# EAGLE schematic OBC (EAGLE 9.6.0)

## Sheet 1 of 6: SMC General
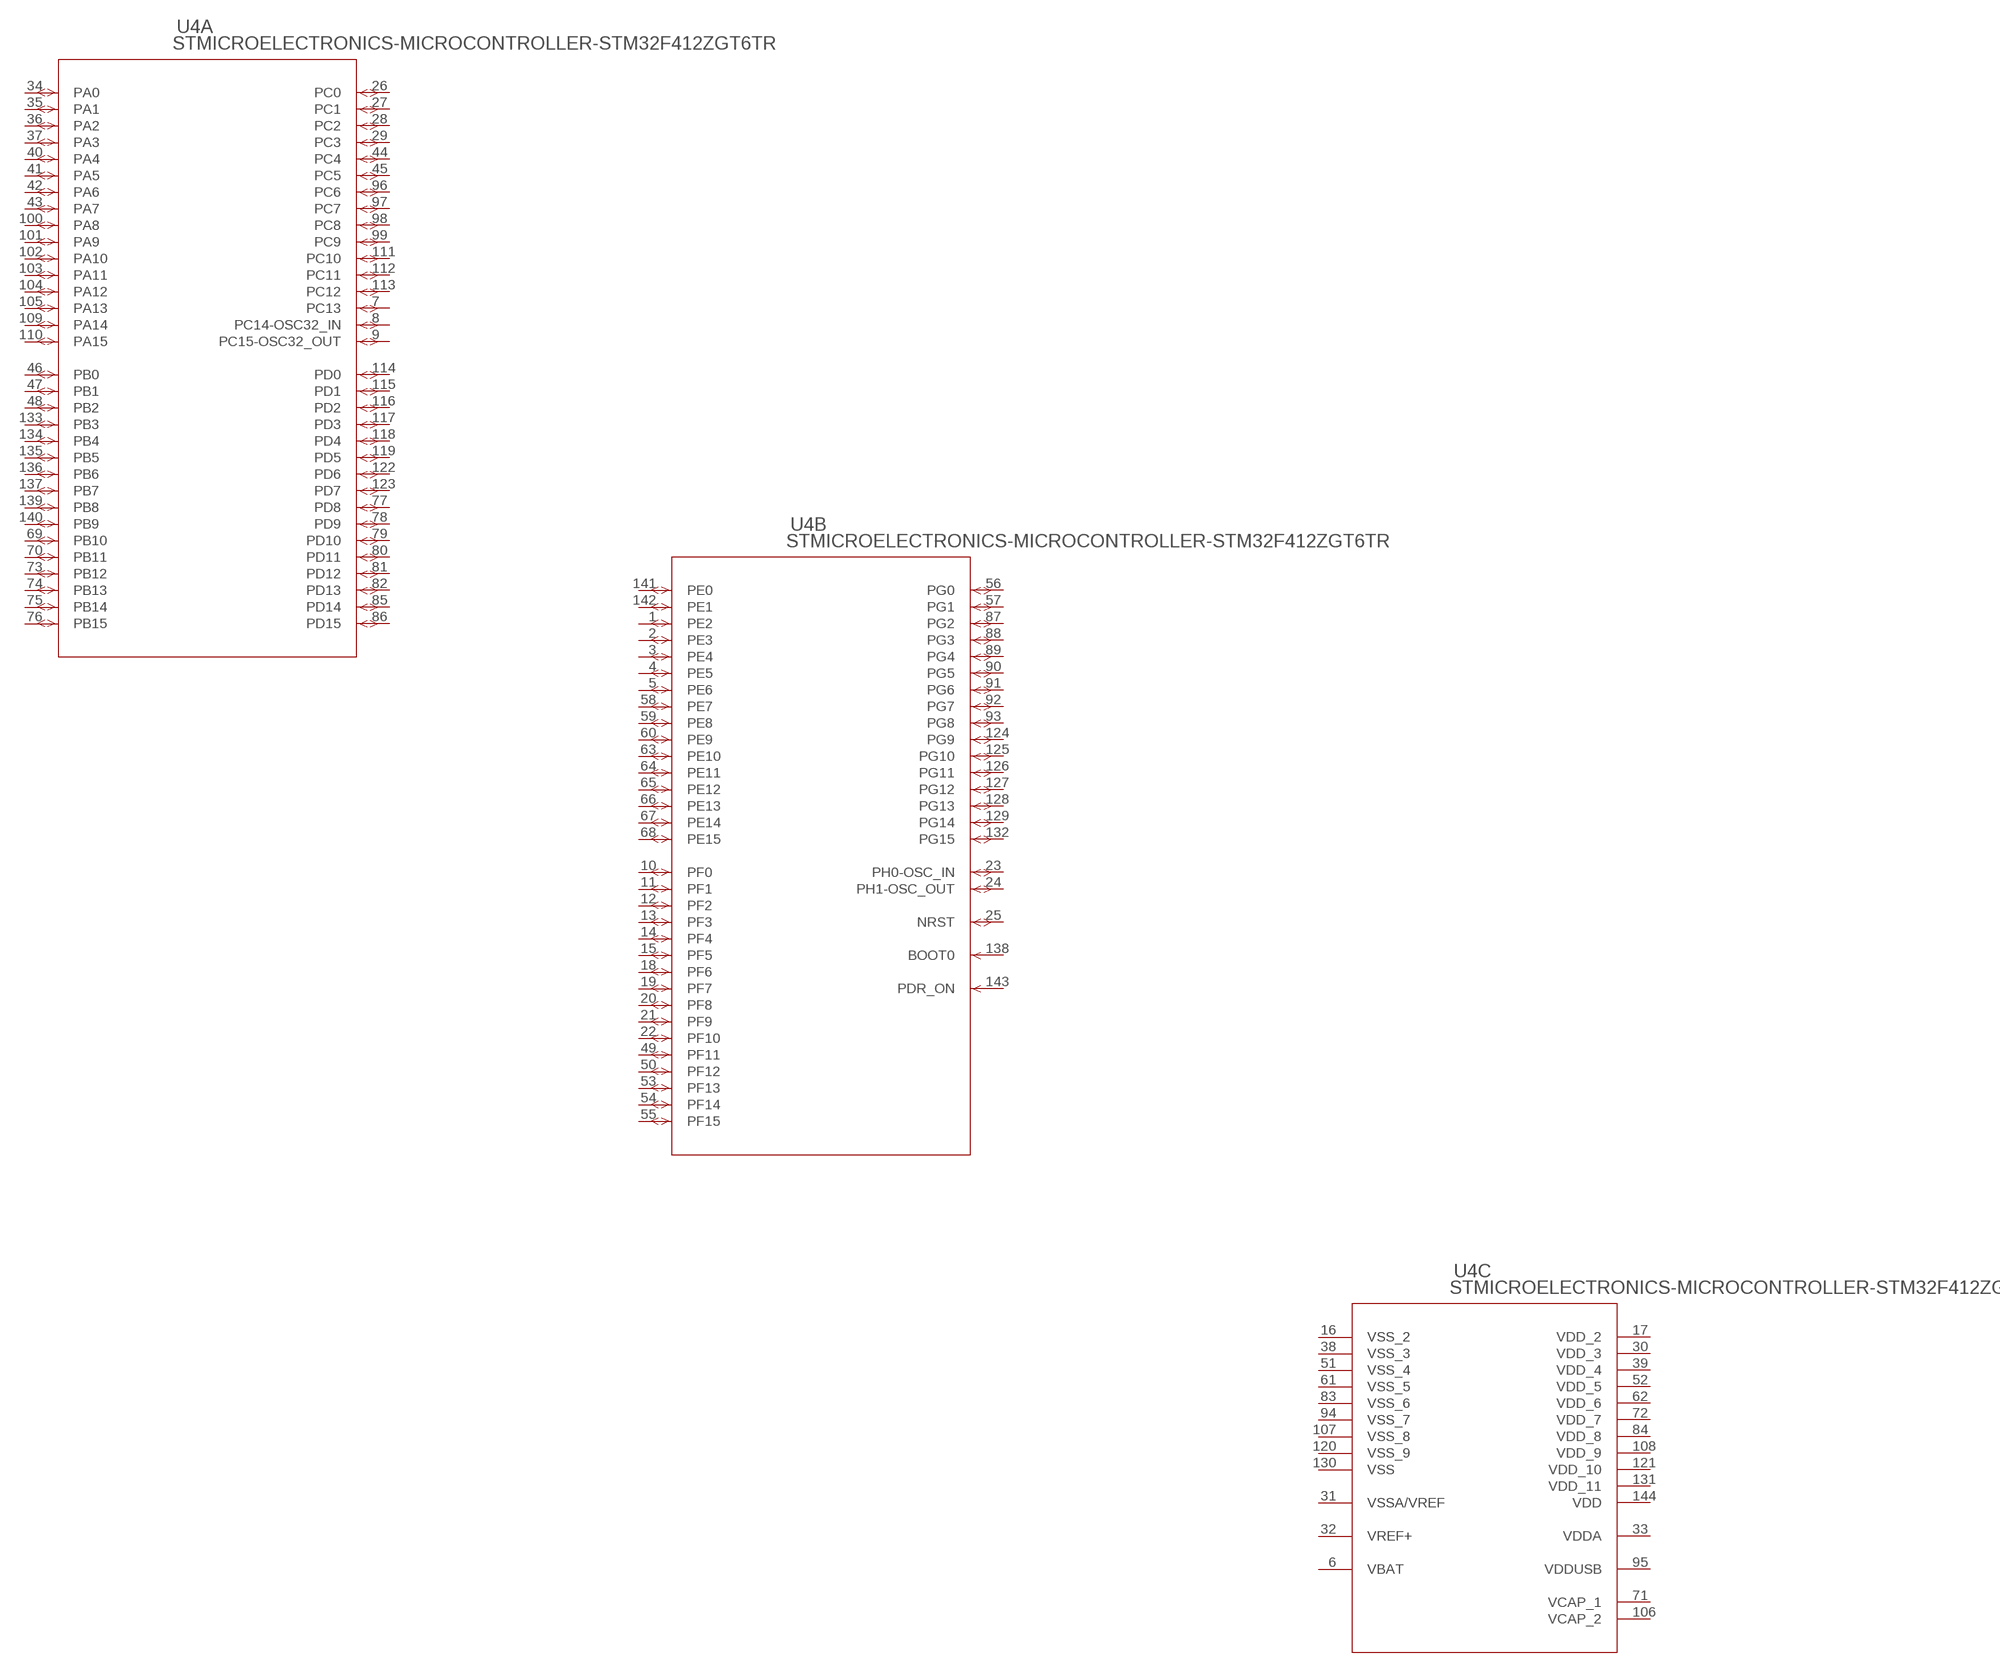
[diagram p0: schematic, sheet 1]

### Parts
U4  STMICROELECTRONICS-MICROCONTROLLER-STM32F412ZGT6TR  [STMICROELECTRONICS-MICROCONTROLLER-STM32F412ZGT6TR]
Unconnected: U4.1(B:PE2) U4.2(B:PE3) U4.3(B:PE4) U4.4(B:PE5) U4.5(B:PE6) U4.7(A:PC13) U4.8(A:PC14-OSC32_IN) U4.9(A:PC15-OSC32_OUT) U4.10(B:PF0) U4.11(B:PF1) U4.12(B:PF2) U4.13(B:PF3) U4.14(B:PF4) U4.15(B:PF5) U4.18(B:PF6) U4.19(B:PF7) U4.20(B:PF8) U4.21(B:PF9) U4.22(B:PF10) U4.23(B:PH0-OSC_IN) U4.24(B:PH1-OSC_OUT) U4.25(B:NRST) U4.26(A:PC0) U4.27(A:PC1) U4.28(A:PC2) U4.29(A:PC3) U4.34(A:PA0) U4.35(A:PA1) U4.36(A:PA2) U4.37(A:PA3) U4.40(A:PA4) U4.41(A:PA5) U4.42(A:PA6) U4.43(A:PA7) U4.44(A:PC4) U4.45(A:PC5) U4.46(A:PB0) U4.47(A:PB1) U4.48(A:PB2) U4.49(B:PF11) U4.50(B:PF12) U4.53(B:PF13) U4.54(B:PF14) U4.55(B:PF15) U4.56(B:PG0) U4.57(B:PG1) U4.58(B:PE7) U4.59(B:PE8) U4.60(B:PE9) U4.63(B:PE10) U4.64(B:PE11) U4.65(B:PE12) U4.66(B:PE13) U4.67(B:PE14) U4.68(B:PE15) U4.69(A:PB10) U4.70(A:PB11) U4.73(A:PB12) U4.74(A:PB13) U4.75(A:PB14) U4.76(A:PB15) U4.77(A:PD8) U4.78(A:PD9) U4.79(A:PD10) U4.80(A:PD11) U4.81(A:PD12) U4.82(A:PD13) U4.85(A:PD14) U4.86(A:PD15) U4.87(B:PG2) U4.88(B:PG3) U4.89(B:PG4) U4.90(B:PG5) U4.91(B:PG6) U4.92(B:PG7) U4.93(B:PG8) U4.96(A:PC6) U4.97(A:PC7) U4.98(A:PC8) U4.99(A:PC9) U4.100(A:PA8) U4.101(A:PA9) U4.102(A:PA10) U4.103(A:PA11) U4.104(A:PA12) U4.105(A:PA13) U4.109(A:PA14) U4.110(A:PA15) U4.111(A:PC10) U4.112(A:PC11) U4.113(A:PC12) U4.114(A:PD0) U4.115(A:PD1) U4.116(A:PD2) U4.117(A:PD3) U4.118(A:PD4) U4.119(A:PD5) U4.122(A:PD6) U4.123(A:PD7) U4.124(B:PG9) U4.125(B:PG10) U4.126(B:PG11) U4.127(B:PG12) U4.128(B:PG13) U4.129(B:PG14) U4.132(B:PG15) U4.133(A:PB3) U4.134(A:PB4) U4.135(A:PB5) U4.136(A:PB6) U4.137(A:PB7) U4.138(B:BOOT0) U4.139(A:PB8) U4.140(A:PB9) U4.141(B:PE0) U4.142(B:PE1) U4.143(B:PDR_ON)

## Sheet 2 of 6: Regulator General
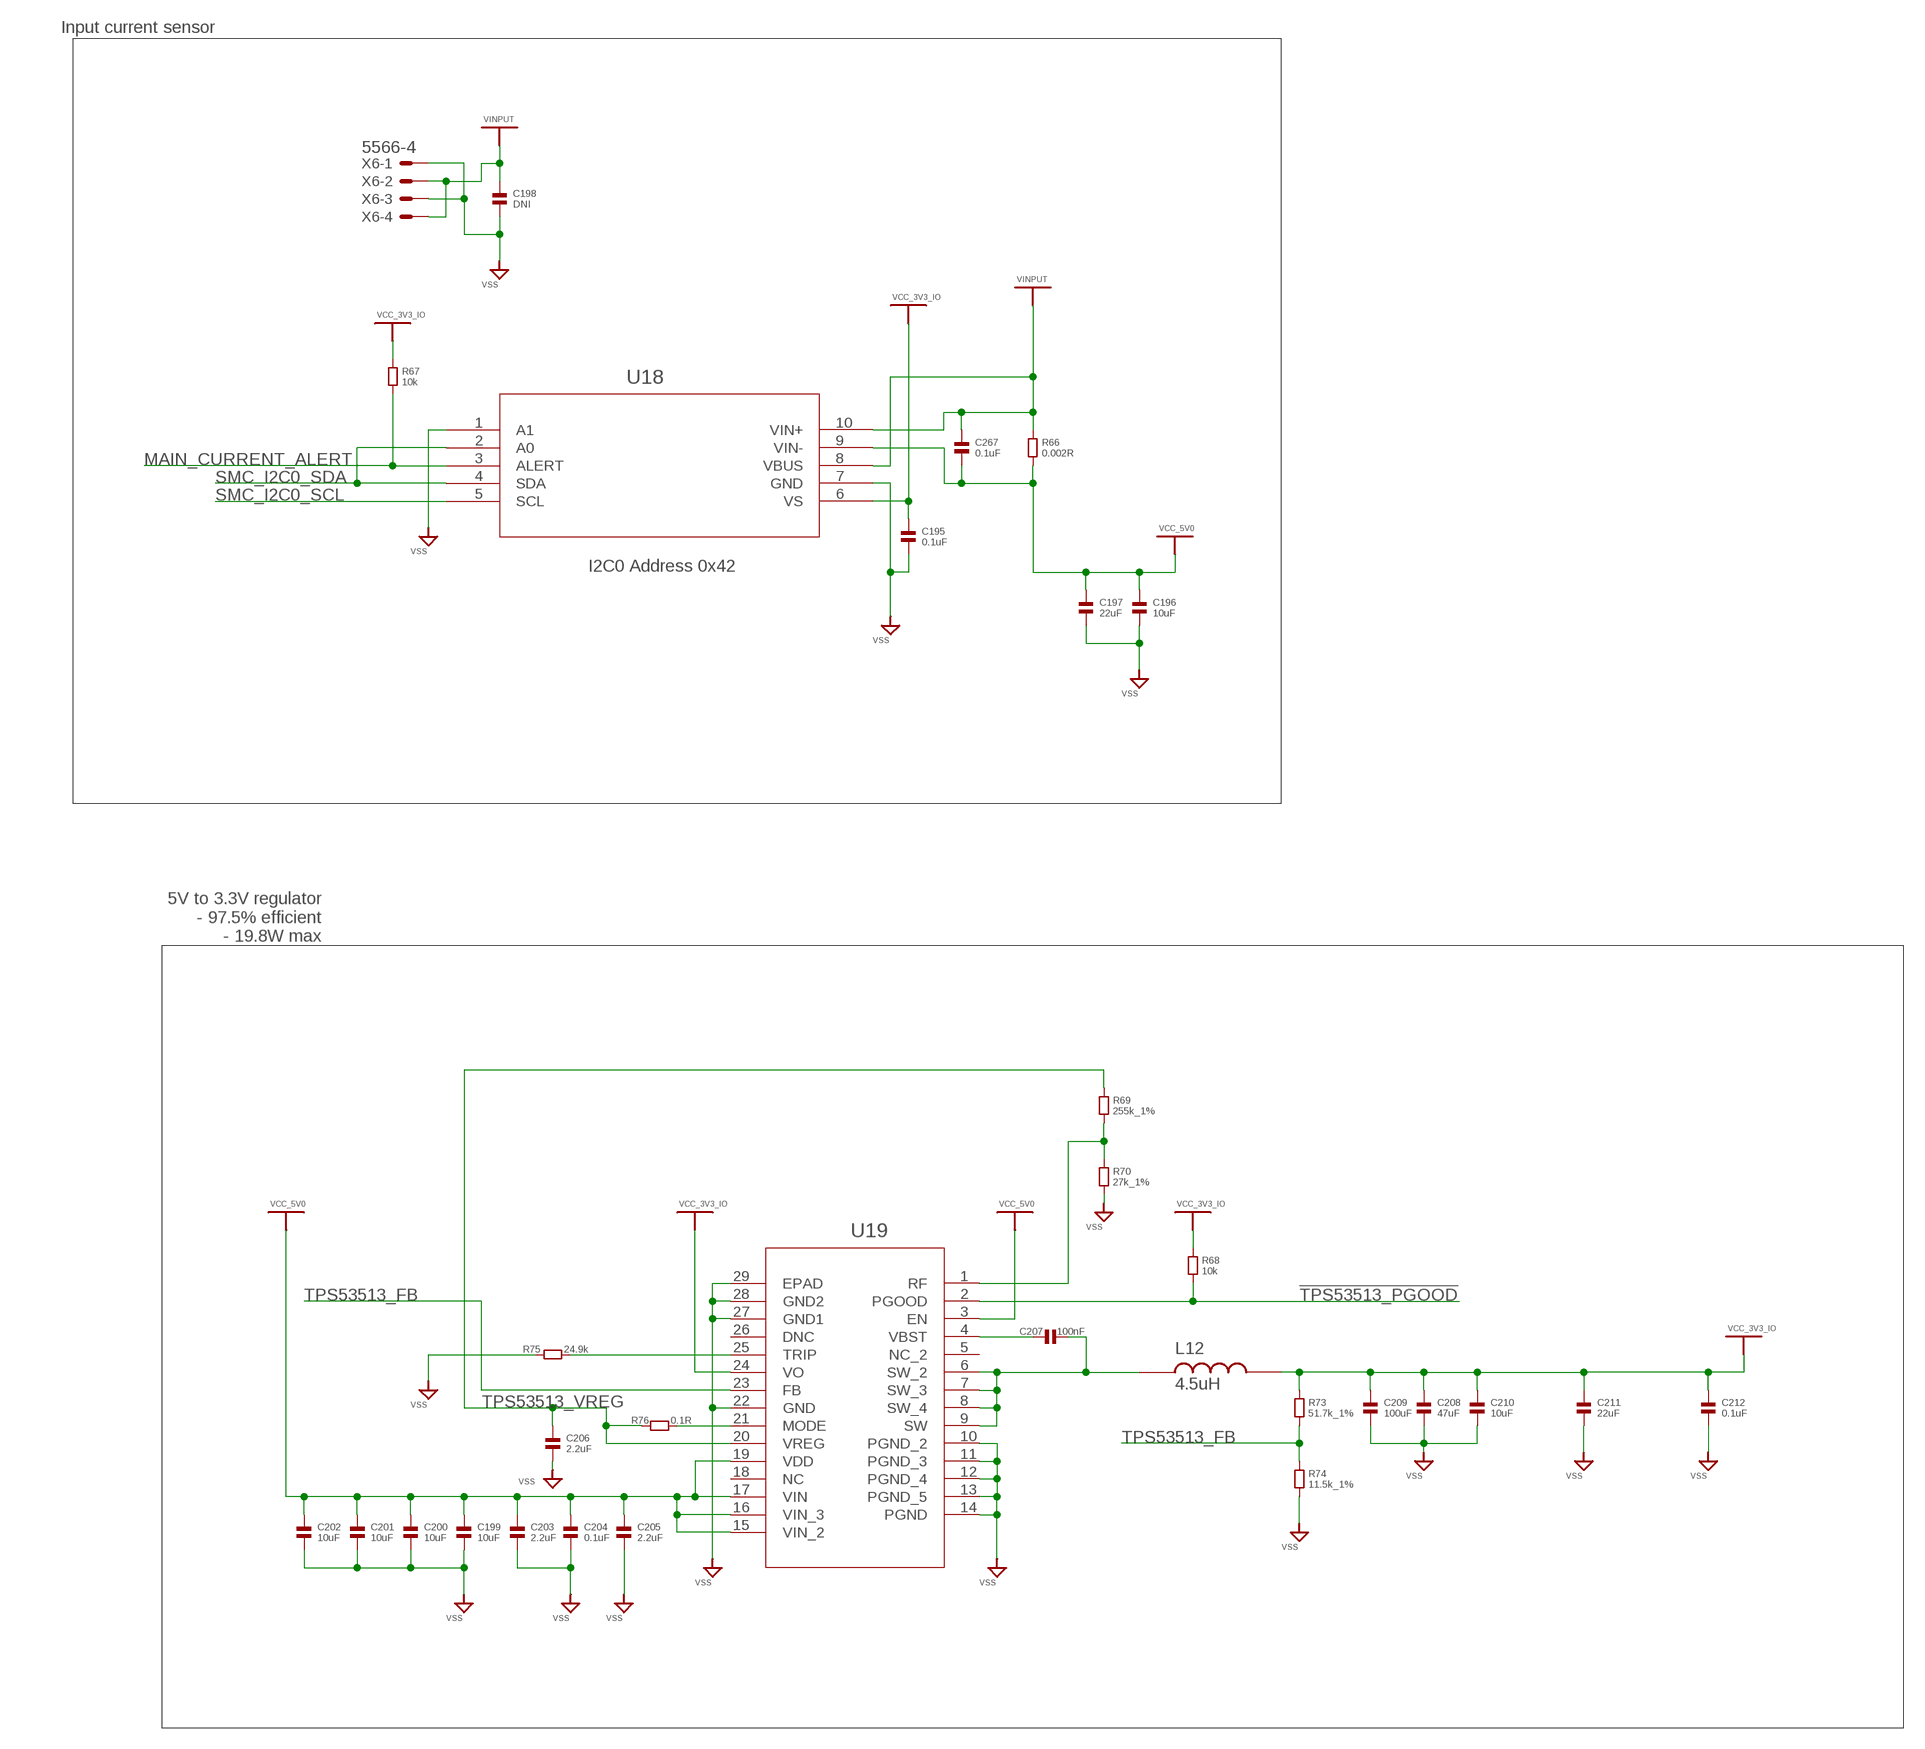
[diagram p1: schematic, sheet 2]

### Parts
C195  0.1uF  CAPACITOR.0603  [0603]
C196  10uF  CAPACITOR.0805  [0805]
C197  22uF  CAPACITOR.0805  [0805]
C198  DNI  CAPACITOR.0805  [0805]
C199  10uF  CAPACITOR.0805  [0805]
C200  10uF  CAPACITOR.0805  [0805]
C201  10uF  CAPACITOR.0805  [0805]
C202  10uF  CAPACITOR.0805  [0805]
C203  2.2uF  CAPACITOR.0603  [0603]
C204  0.1uF  CAPACITOR.0603  [0603]
C205  2.2uF  CAPACITOR.0603  [0603]
C206  2.2uF  CAPACITOR.0603  [0603]
C207  100nF  CAPACITOR.0805  [0805]
C208  47uF  CAPACITOR.1206  [1206]
C209  100uF  CAPACITOR.1206  [1206]
C210  10uF  CAPACITOR.0805  [0805]
C211  22uF  CAPACITOR.0805  [0805]
C212  0.1uF  CAPACITOR.0805  [0805]
C267  0.1uF  CAPACITOR.0603  [0603]
L12  4.5uH  BOURNS-INDUCTOR-SRR1208-4R5ML  [BOURNS-INDUCTOR-SRR1208-4R5ML]
R66  0.002R  RESISTOR.1812  [1812]
R67  10k  RESISTOR.0603  [0603]
R68  10k  RESISTOR.0603  [0603]
R69  255k_1%  RESISTOR.0603  [0603]
R70  27k_1%  RESISTOR.0603  [0603]
R73  51.7k_1%  RESISTOR.0603  [0603]
R74  11.5k_1%  RESISTOR.0603  [0603]
R75  24.9k  RESISTOR.0603  [0603]
R76  0.1R  RESISTOR.0603  [0603]
U18  TEXAS_INSTRUMENTS-CURRENT_MONITOR-INA226_DGS_10  [TEXAS_INSTRUMENTS-CURRENT_MONITOR-INA226_DGS_10]
U19  TEXAS_INSTRUMENTS-BUCK_CONVERTER-TPS53513RVER  [RVE28_TEX]
X6  5566-4  [5566-4]

### Nets
!TPS53513_PGOOD: R68.2 U19.2(PGOOD)
MAIN_CURRENT_ALERT: R67.2 U18.3(ALERT)
N$43: R69.2 R70.1 U19.1(RF)
N$46: C207.1 U19.4(VBST)
N$47: C207.2 L12.1 U19.6(SW_2) U19.7(SW_3) U19.8(SW_4) U19.9(SW)
N$48: R75.2 U19.25(TRIP)
N$49: R76.2 U19.21(MODE)
SMC_I2C0_SCL: U18.5(SCL) ; also sheet 3,4
SMC_I2C0_SDA: U18.2(A0) U18.4(SDA) ; also sheet 3,4
TPS53513_FB: R73.2 R74.1 U19.23(FB)
TPS53513_VREG: C206.1 R69.1 R76.1 U19.20(VREG)
VCC_3V3_IO: C195.1 C208.1 C209.1 C210.1 C211.1 C212.1 L12.2 R67.1 R68.1 R73.1 U18.6(VS) U19.24(VO) ; also sheet 3,4,5,6
VCC_5V0: C196.1 C197.1 C199.1 C200.1 C201.1 C202.1 C203.1 C204.1 C205.1 C267.2 R66.2 U18.9(VIN-) U19.3(EN) U19.15(VIN_2) U19.16(VIN_3) U19.17(VIN) U19.19(VDD) ; also sheet 3
VINPUT: C198.1 C267.1 R66.1 U18.8(VBUS) U18.10(VIN+) X6.2 X6.4
VSS: C195.2 C196.2 C197.2 C198.2 C199.2 C200.2 C201.2 C202.2 C203.2 C204.2 C205.2 C206.2 C208.2 C209.2 C210.2 C211.2 C212.2 R70.2 R74.2 R75.1 U18.1(A1) U18.7(GND) U19.10(PGND_2) U19.11(PGND_3) U19.12(PGND_4) U19.13(PGND_5) U19.14(PGND) U19.22(GND) U19.27(GND1) U19.28(GND2) U19.29(EPAD) X6.1 X6.3 ; also sheet 3,4,5,6
Unconnected: U19.5(NC_2) U19.18(NC) U19.26(DNC)

### Notes on the sheet
- Input current sensor
- I2C0 Address 0x42
- 5V to 3.3V regulator
  - 97.5% efficient
  - 19.8W max

## Sheet 3 of 6: Magnetorquer Drive Core
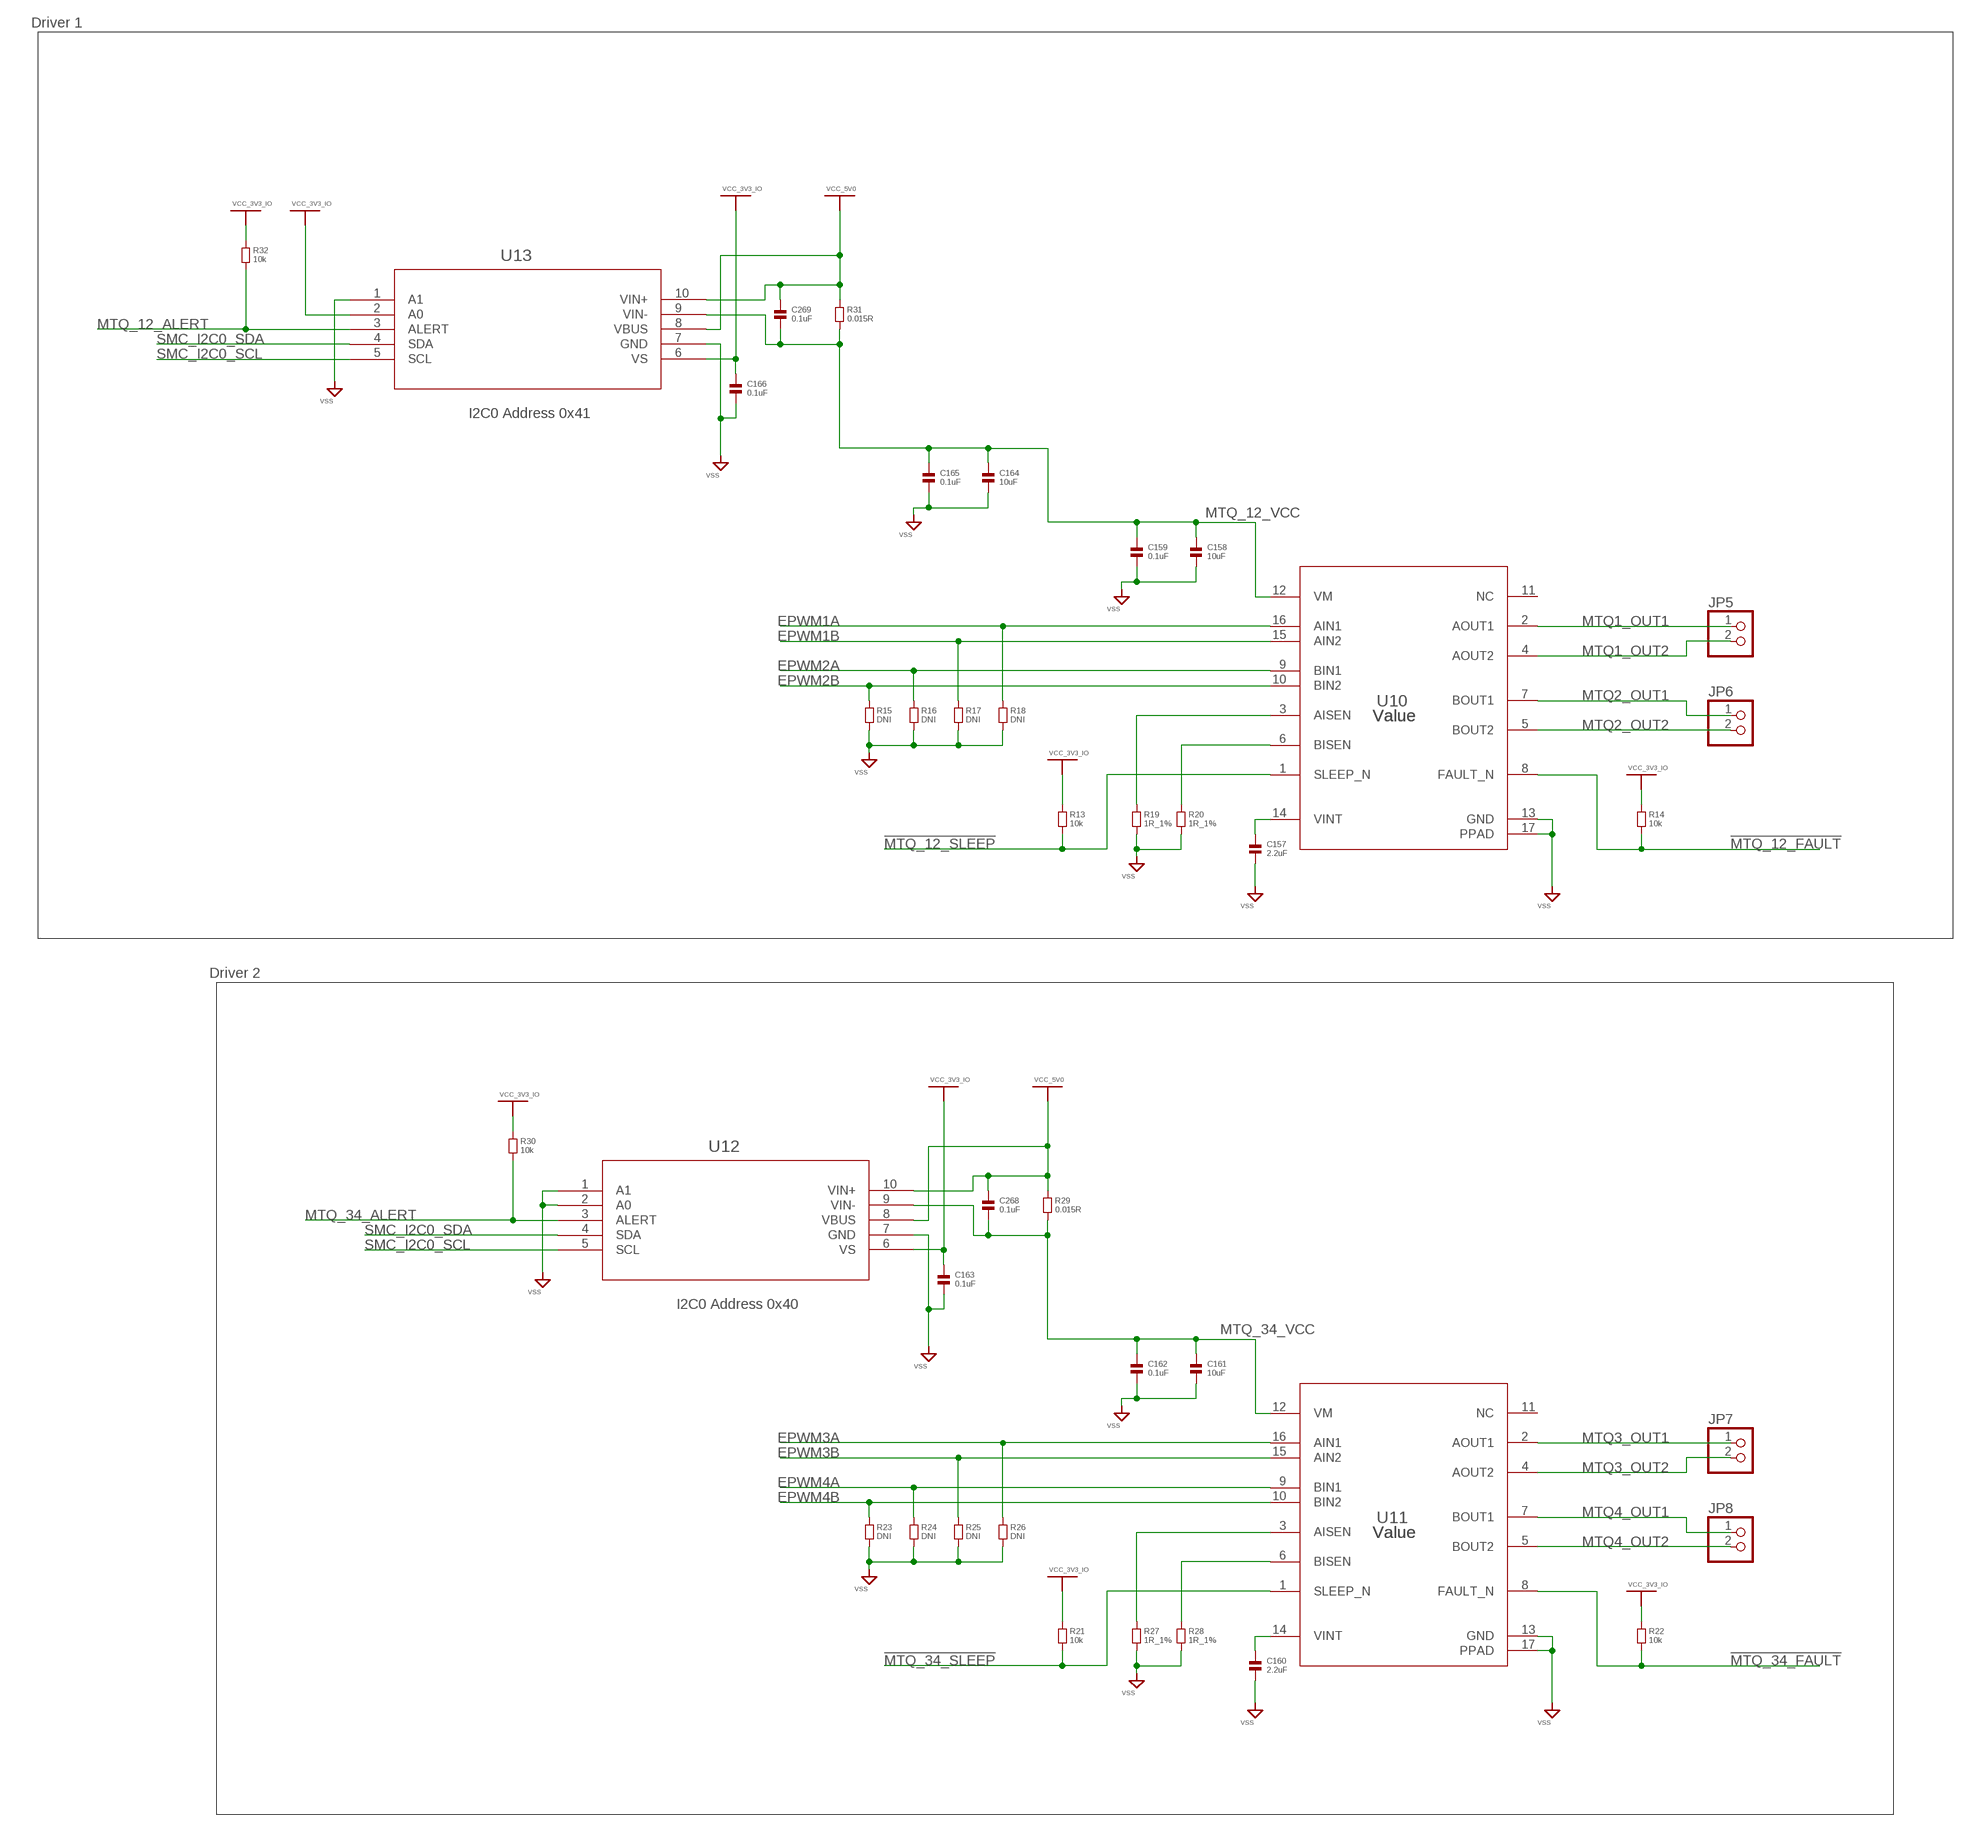
[diagram p2: schematic, sheet 3]

### Parts
C157  2.2uF  CAPACITOR.0603  [0603]
C158  10uF  CAPACITOR.0805  [0805]
C159  0.1uF  CAPACITOR.0603  [0603]
C160  2.2uF  CAPACITOR.0603  [0603]
C161  10uF  CAPACITOR.0805  [0805]
C162  0.1uF  CAPACITOR.0603  [0603]
C163  0.1uF  CAPACITOR.0603  [0603]
C164  10uF  CAPACITOR.0805  [0805]
C165  0.1uF  CAPACITOR.0603  [0603]
C166  0.1uF  CAPACITOR.0603  [0603]
C268  0.1uF  CAPACITOR.0603  [0603]
C269  0.1uF  CAPACITOR.0603  [0603]
JP5  PINHD-1X2  [1X02]
JP6  PINHD-1X2  [1X02]
JP7  PINHD-1X2  [1X02]
JP8  PINHD-1X2  [1X02]
R13  10k  RESISTOR.0603  [0603]
R14  10k  RESISTOR.0603  [0603]
R15  DNI  RESISTOR.0603  [0603]
R16  DNI  RESISTOR.0603  [0603]
R17  DNI  RESISTOR.0603  [0603]
R18  DNI  RESISTOR.0603  [0603]
R19  1R_1%  RESISTOR.0603  [0603]
R20  1R_1%  RESISTOR.0603  [0603]
R21  10k  RESISTOR.0603  [0603]
R22  10k  RESISTOR.0603  [0603]
R23  DNI  RESISTOR.0603  [0603]
R24  DNI  RESISTOR.0603  [0603]
R25  DNI  RESISTOR.0603  [0603]
R26  DNI  RESISTOR.0603  [0603]
R27  1R_1%  RESISTOR.0603  [0603]
R28  1R_1%  RESISTOR.0603  [0603]
R29  0.015R  RESISTOR.1206  [1206]
R30  10k  RESISTOR.0603  [0603]
R31  0.015R  RESISTOR.1206  [1206]
R32  10k  RESISTOR.0603  [0603]
U10  Value  TEXAS_INSTRUMENTS-MOTOR_PWM_DRIVER-DRV8833CPWP  [PWP0016K_N]
U11  Value  TEXAS_INSTRUMENTS-MOTOR_PWM_DRIVER-DRV8833CPWP  [PWP0016K_N]
U12  TEXAS_INSTRUMENTS-CURRENT_MONITOR-INA226_DGS_10  [TEXAS_INSTRUMENTS-CURRENT_MONITOR-INA226_DGS_10]
U13  TEXAS_INSTRUMENTS-CURRENT_MONITOR-INA226_DGS_10  [TEXAS_INSTRUMENTS-CURRENT_MONITOR-INA226_DGS_10]

### Nets
!MTQ_12_FAULT: R14.2 U10.8(FAULT_N)
!MTQ_12_SLEEP: R13.2 U10.1(SLEEP_N)
!MTQ_34_FAULT: R22.2 U11.8(FAULT_N)
!MTQ_34_SLEEP: R21.2 U11.1(SLEEP_N)
EPWM1A: R18.1 U10.16(AIN1)
EPWM1B: R17.1 U10.15(AIN2)
EPWM2A: R16.1 U10.9(BIN1)
EPWM2B: R15.1 U10.10(BIN2)
EPWM3A: R26.1 U11.16(AIN1)
EPWM3B: R25.1 U11.15(AIN2)
EPWM4A: R24.1 U11.9(BIN1)
EPWM4B: R23.1 U11.10(BIN2)
MTQ1_OUT1: JP5.1 U10.2(AOUT1)
MTQ1_OUT2: JP5.2 U10.4(AOUT2)
MTQ2_OUT1: JP6.1 U10.7(BOUT1)
MTQ2_OUT2: JP6.2 U10.5(BOUT2)
MTQ3_OUT1: JP7.1 U11.2(AOUT1)
MTQ3_OUT2: JP7.2 U11.4(AOUT2)
MTQ4_OUT1: JP8.1 U11.7(BOUT1)
MTQ4_OUT2: JP8.2 U11.5(BOUT2)
MTQ_12_ALERT: R32.2 U13.3(ALERT)
MTQ_12_VCC: C158.1 C159.1 C164.1 C165.1 C269.2 R31.2 U10.12(VM) U13.9(VIN-)
MTQ_34_ALERT: R30.2 U12.3(ALERT)
MTQ_34_VCC: C161.1 C162.1 C268.2 R29.2 U11.12(VM) U12.9(VIN-)
N$10: C157.1 U10.14(VINT)
N$12: R19.1 U10.3(AISEN)
N$13: R20.1 U10.6(BISEN)
N$14: C160.1 U11.14(VINT)
N$15: R27.1 U11.3(AISEN)
N$16: R28.1 U11.6(BISEN)
SMC_I2C0_SCL: U12.5(SCL) U13.5(SCL) ; also sheet 2,4
SMC_I2C0_SDA: U12.4(SDA) U13.4(SDA) ; also sheet 2,4
VCC_3V3_IO: C163.1 C166.1 R13.1 R14.1 R21.1 R22.1 R30.1 R32.1 U12.6(VS) U13.2(A0) U13.6(VS) ; also sheet 2,4,5,6
VCC_5V0: C268.1 C269.1 R29.1 R31.1 U12.8(VBUS) U12.10(VIN+) U13.8(VBUS) U13.10(VIN+) ; also sheet 2
VSS: C157.2 C158.2 C159.2 C160.2 C161.2 C162.2 C163.2 C164.2 C165.2 C166.2 R15.2 R16.2 R17.2 R18.2 R19.2 R20.2 R23.2 R24.2 R25.2 R26.2 R27.2 R28.2 U10.13(GND) U10.17(PPAD) U11.13(GND) U11.17(PPAD) U12.1(A1) U12.2(A0) U12.7(GND) U13.1(A1) U13.7(GND) ; also sheet 2,4,5,6
Unconnected: U10.11(NC) U11.11(NC)

### Notes on the sheet
- Driver 1
- I2C0 Address 0x41
- Driver 2
- I2C0 Address 0x40

## Sheet 4 of 6: IMUs
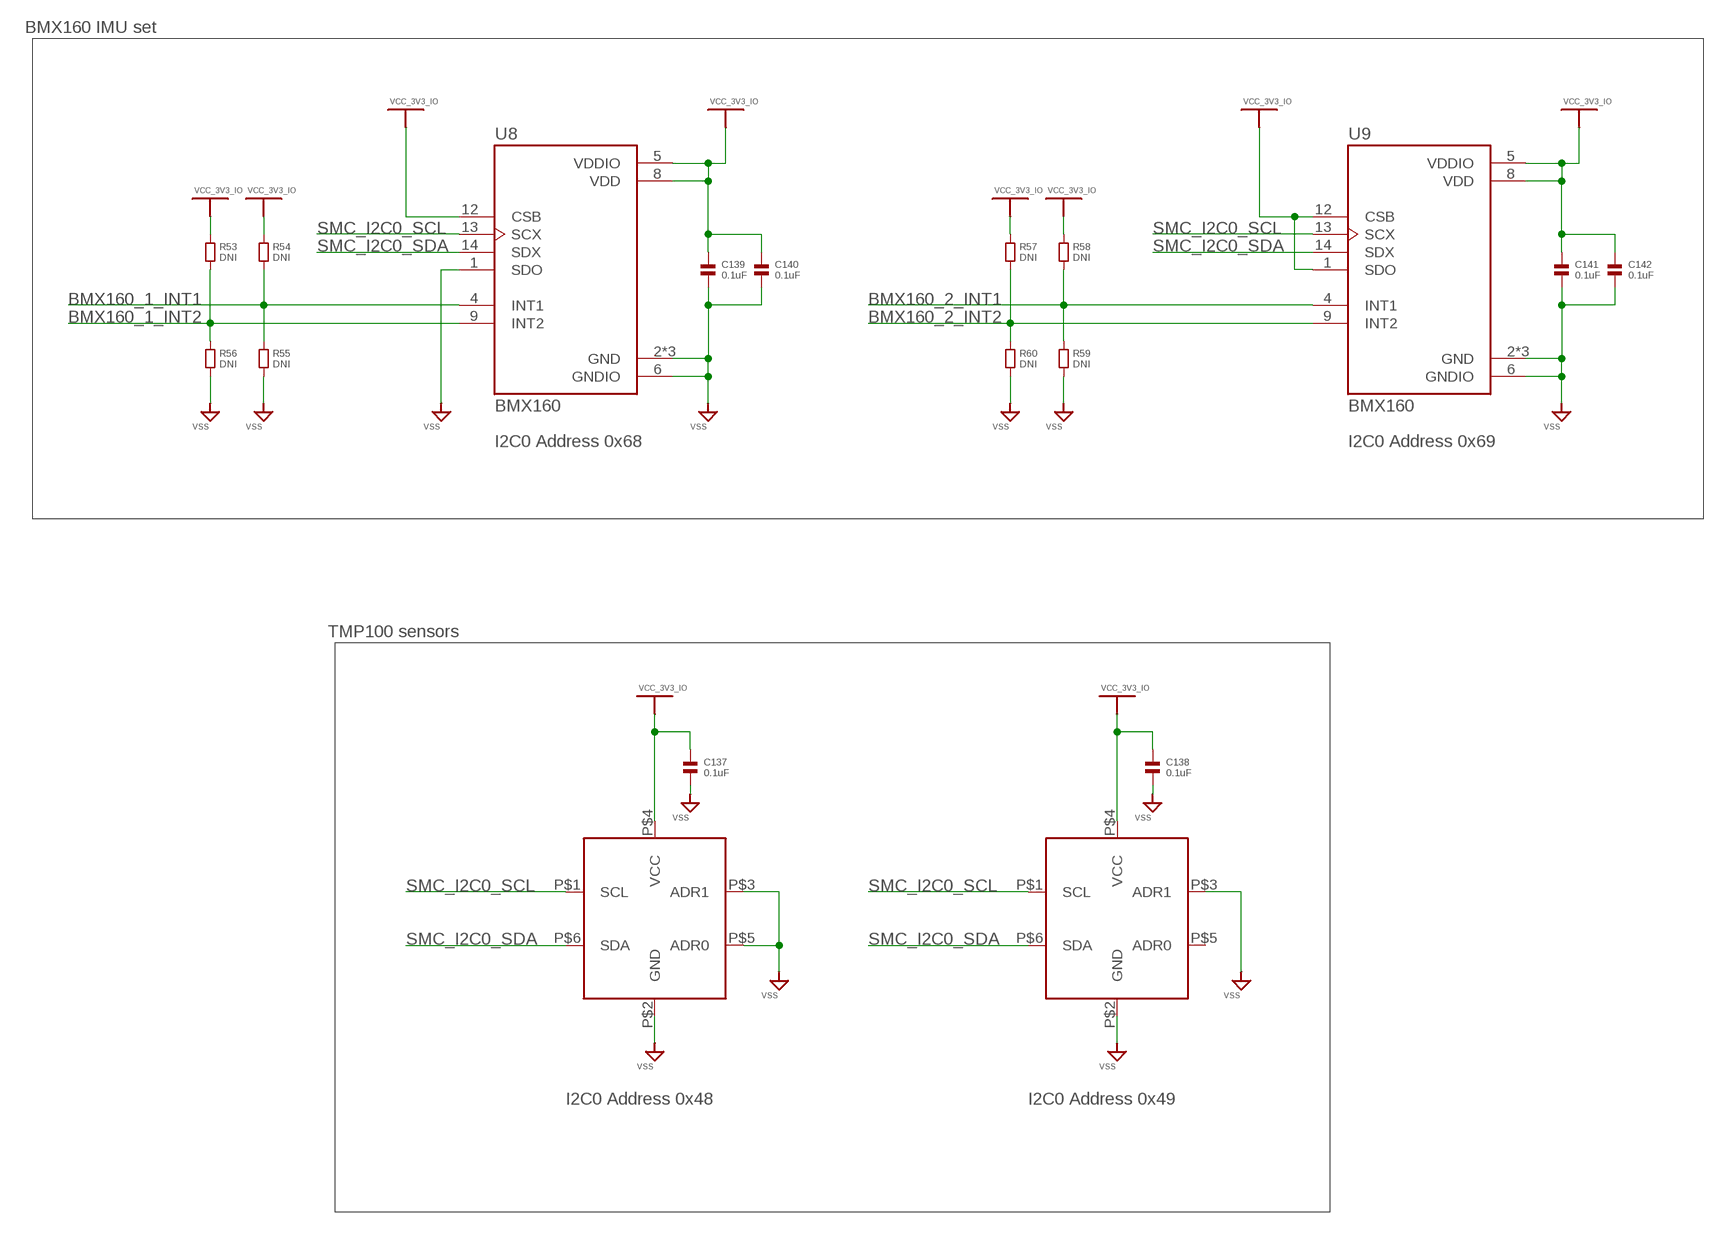
[diagram p3: schematic, sheet 4]

### Parts
C137  0.1uF  CAPACITOR.0603  [0603]
C138  0.1uF  CAPACITOR.0603  [0603]
C139  0.1uF  CAPACITOR.0603  [0603]
C140  0.1uF  CAPACITOR.0603  [0603]
C141  0.1uF  CAPACITOR.0603  [0603]
C142  0.1uF  CAPACITOR.0603  [0603]
R53  DNI  RESISTOR.0603  [0603]
R54  DNI  RESISTOR.0603  [0603]
R55  DNI  RESISTOR.0603  [0603]
R56  DNI  RESISTOR.0603  [0603]
R57  DNI  RESISTOR.0603  [0603]
R58  DNI  RESISTOR.0603  [0603]
R59  DNI  RESISTOR.0603  [0603]
R60  DNI  RESISTOR.0603  [0603]
U7  TMP100  [SOT23-6]
U8  BMX160  [PQFN50P250X300X100-14N]
U9  BMX160  [PQFN50P250X300X100-14N]
U34  TMP100  [SOT23-6]

### Nets
BMX160_1_INT1: R54.2 R55.1 U8.4(INT1)
BMX160_1_INT2: R53.2 R56.1 U8.9(INT2)
BMX160_2_INT1: R58.2 R59.1 U9.4(INT1)
BMX160_2_INT2: R57.2 R60.1 U9.9(INT2)
SMC_I2C0_SCL: U7.P$1(SCL) U8.13(SCX) U9.13(SCX) U34.P$1(SCL) ; also sheet 2,3
SMC_I2C0_SDA: U7.P$6(SDA) U8.14(SDX) U9.14(SDX) U34.P$6(SDA) ; also sheet 2,3
VCC_3V3_IO: C137.1 C138.1 C139.1 C140.1 C141.1 C142.1 R53.1 R54.1 R57.1 R58.1 U7.P$4(VCC) U8.5(VDDIO) U8.8(VDD) U8.12(CSB) U9.1(SDO) U9.5(VDDIO) U9.8(VDD) U9.12(CSB) U34.P$4(VCC) ; also sheet 2,3,5,6
VSS: C137.2 C138.2 C139.2 C140.2 C141.2 C142.2 R55.2 R56.2 R59.2 R60.2 U7.P$2(GND) U7.P$3(ADR1) U8.1(SDO) U8.2(GND) U8.3(GND) U8.6(GNDIO) U8.7(GND) U9.2(GND) U9.3(GND) U9.6(GNDIO) U9.7(GND) U34.P$2(GND) U34.P$3(ADR1) U34.P$5(ADR0) ; also sheet 2,3,5,6
Unconnected: U7.P$5(ADR0)

### Notes on the sheet
- BMX160 IMU set
- I2C0 Address 0x68 | I2C0 Address 0x69
- TMP100 sensors
- I2C0 Address 0x48 | I2C0 Address 0x49

## Sheet 5 of 6: Comms Microcontroller 1 + RF Transceiver
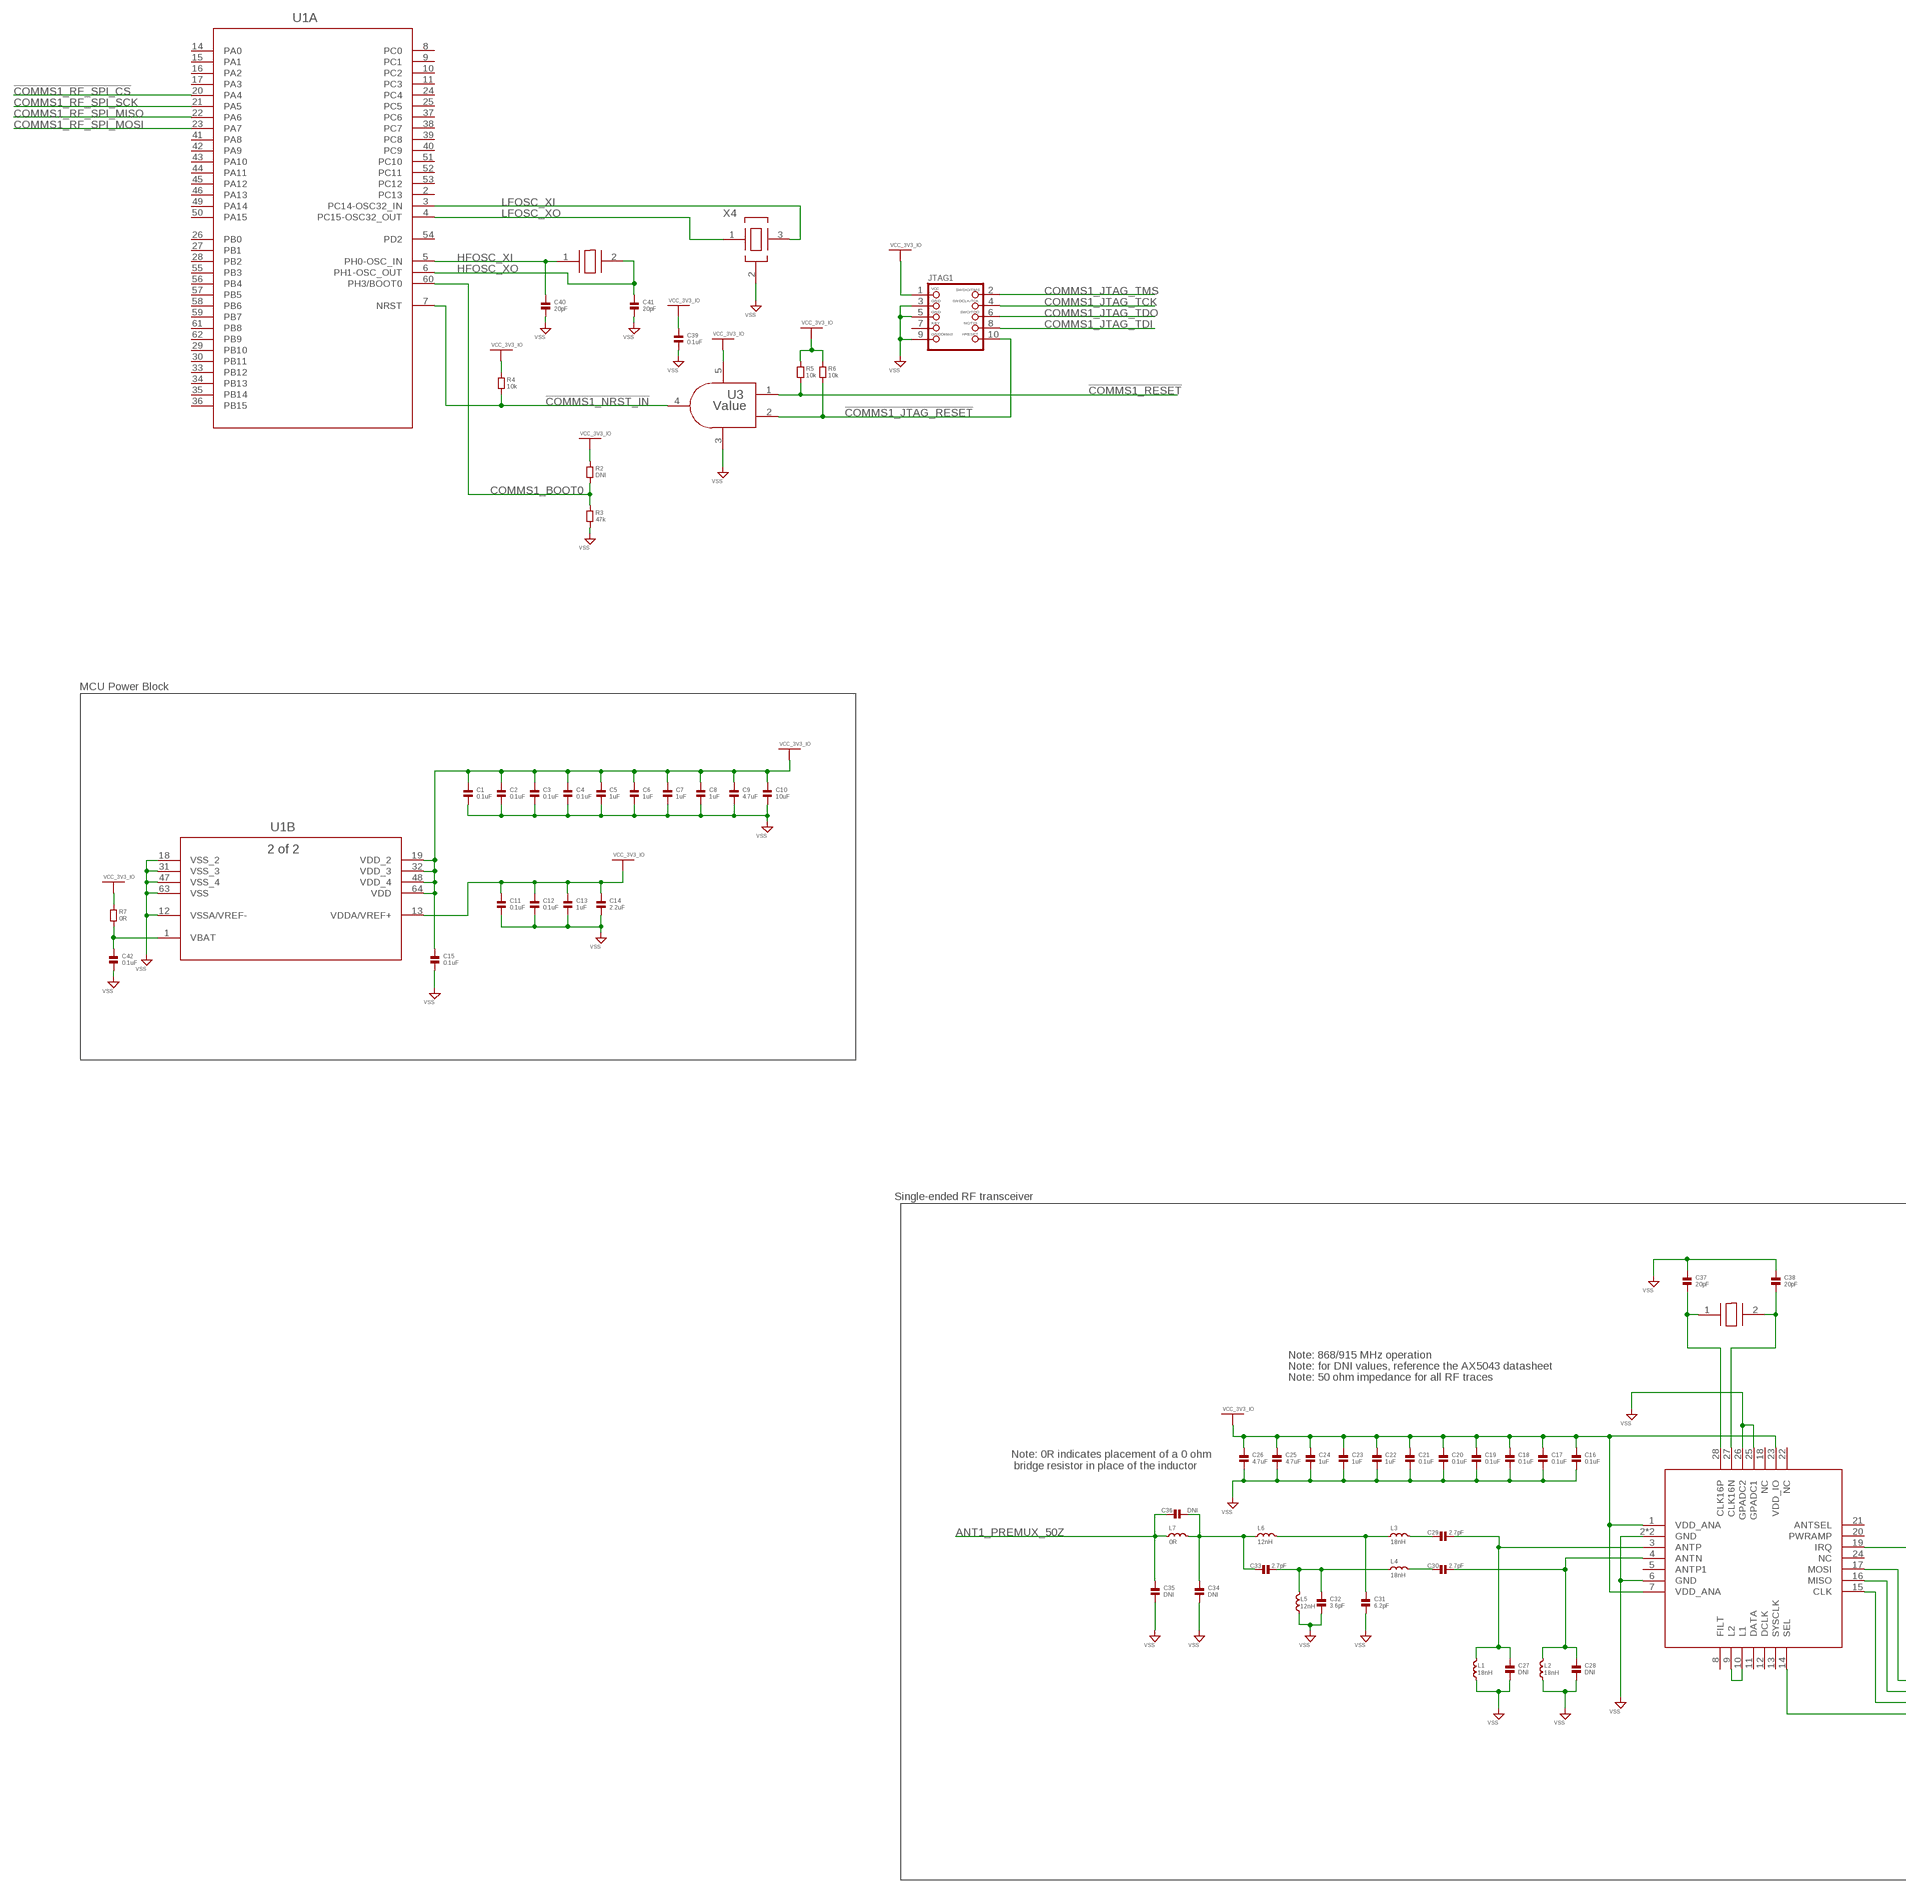
[diagram p4: schematic, sheet 5, part 1 of 2]
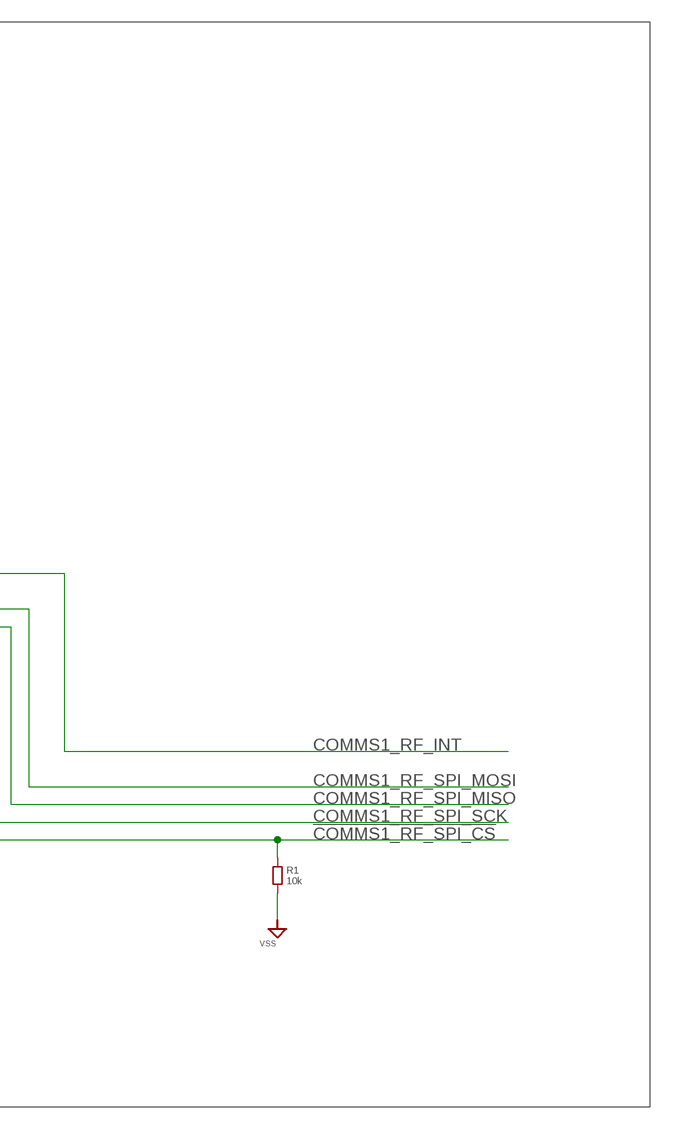
[diagram p5: schematic, sheet 5, part 2 of 2]

### Parts
C1  0.1uF  CAPACITOR.0603  [0603]
C2  0.1uF  CAPACITOR.0603  [0603]
C3  0.1uF  CAPACITOR.0603  [0603]
C4  0.1uF  CAPACITOR.0603  [0603]
C5  1uF  CAPACITOR.0603  [0603]
C6  1uF  CAPACITOR.0603  [0603]
C7  1uF  CAPACITOR.0603  [0603]
C8  1uF  CAPACITOR.0603  [0603]
C9  4.7uF  CAPACITOR.0603  [0603]
C10  10uF  CAPACITOR.0603  [0603]
C11  0.1uF  CAPACITOR.0603  [0603]
C12  0.1uF  CAPACITOR.0603  [0603]
C13  1uF  CAPACITOR.0603  [0603]
C14  2.2uF  CAPACITOR.0603  [0603]
C15  0.1uF  CAPACITOR.0603  [0603]
C16  0.1uF  CAPACITOR.0603  [0603]
C17  0.1uF  CAPACITOR.0603  [0603]
C18  0.1uF  CAPACITOR.0603  [0603]
C19  0.1uF  CAPACITOR.0603  [0603]
C20  0.1uF  CAPACITOR.0603  [0603]
C21  0.1uF  CAPACITOR.0603  [0603]
C22  1uF  CAPACITOR.0603  [0603]
C23  1uF  CAPACITOR.0603  [0603]
C24  1uF  CAPACITOR.0603  [0603]
C25  4.7uF  CAPACITOR.0603  [0603]
C26  4.7uF  CAPACITOR.0603  [0603]
C27  DNI  CAPACITOR.0402  [0402]
C28  DNI  CAPACITOR.0402  [0402]
C29  2.7pF  CAPACITOR.0402  [0402]
C30  2.7pF  CAPACITOR.0402  [0402]
C31  6.2pF  CAPACITOR.0402  [0402]
C32  3.6pF  CAPACITOR.0402  [0402]
C33  2.7pF  CAPACITOR.0402  [0402]
C34  DNI  CAPACITOR.0402  [0402]
C35  DNI  CAPACITOR.0402  [0402]
C36  DNI  CAPACITOR.0402  [0402]
C37  20pF  CAPACITOR.0603  [0603]
C38  20pF  CAPACITOR.0603  [0603]
C39  0.1uF  CAPACITOR.0603  [0603]
C40  20pF  CAPACITOR.0603  [0603]
C41  20pF  CAPACITOR.0603  [0603]
C42  0.1uF  CAPACITOR.0603  [0603]
JTAG1  JTAG-CORTEXM3MOLEX  [CORTEXM3_SWD10_MOLEX]
L1  18nH  RF-INDUCTOR.0402  [0402]
L2  18nH  RF-INDUCTOR.0402  [0402]
L3  18nH  RF-INDUCTOR.0402  [0402]
L4  18nH  RF-INDUCTOR.0402  [0402]
L5  12nH  RF-INDUCTOR.0402  [0402]
L6  12nH  RF-INDUCTOR.0402  [0402]
L7  0R  RF-INDUCTOR.0402  [0402]
R1  10k  RESISTOR.0603  [0603]
R2  DNI  RESISTOR.0603  [0603]
R3  47k  RESISTOR.0603  [0603]
R4  10k  RESISTOR.0603  [0603]
R5  10k  RESISTOR.0603  [0603]
R6  10k  RESISTOR.0603  [0603]
R7  0R  RESISTOR.0603  [0603]
U1  STMICROELECTRONICS-MICROCONTROLLER-STM32L431RCT6  [LQFP-64]
U2  ON_SEMICONDUCTOR-RF_TRANSCEIVER-AX5043  [ON_SEMICONDUCTOR-RF_TRANSCEIVER-AX5043]
U3  Value  TEXAS_INSTRUMENTS-AND_GATE-SN74LVC1G08DBVR  [TEXAS_INSTRUMENTS-AND_GATE-SN74LVC1G08DBVR]
X1  16MHz  ECS_INC-OSCILLATOR-ECS-160-20-23A-TR  [ECS_INC-OSCILLATOR-ECS-160-20-23A-TR]
X3  16MHz  ECS_INC-OSCILLATOR-ECS-160-20-23A-TR  [ECS_INC-OSCILLATOR-ECS-160-20-23A-TR]
X4  ECS_INC-OSCILLATOR-ECS-.327-12.5-1210B-N-TR  [ECS_INC-OSCILLATOR-ECS-.327-12.5-1210B-N-TR]

### Nets
!COMMS1_JTAG_RESET: JTAG1.10 R6.2 U3.2(B)
!COMMS1_NRST_IN: R4.2 U1.7(A:NRST) U3.4(Y)
!COMMS1_RESET: R5.2 U3.1(A)
!COMMS1_RF_SPI_CS: R1.1 U1.20(A:PA4) U2.14(SEL)
ANT1_PREMUX_50Z: C35.1 C36.1 L7.1 ; also sheet 6
COMMS1_BOOT0: R2.2 R3.1 U1.60(A:PH3/BOOT0)
COMMS1_JTAG_TCK: JTAG1.4
COMMS1_JTAG_TDI: JTAG1.8
COMMS1_JTAG_TDO: JTAG1.6
COMMS1_JTAG_TMS: JTAG1.2
COMMS1_RF_INT: U2.19(IRQ)
COMMS1_RF_SPI_MISO: U1.22(A:PA6) U2.16(MISO)
COMMS1_RF_SPI_MOSI: U1.23(A:PA7) U2.17(MOSI)
COMMS1_RF_SPI_SCK: U1.21(A:PA5) U2.15(CLK)
HFOSC_XI: C40.1 U1.5(A:PH0-OSC_IN) X3.1(XI)
HFOSC_XO: C41.1 U1.6(A:PH1-OSC_OUT) X3.2(XO)
LFOSC_XI: U1.3(A:PC14-OSC32_IN) X4.3(XO)
LFOSC_XO: U1.4(A:PC15-OSC32_OUT) X4.1(XI)
N$1: U2.9(L2) U2.10(L1)
N$2: C32.1 C33.2 L4.1 L5.2
N$3: C29.1 L3.2
N$4: C27.1 C29.2 L1.2 U2.3(ANTP)
N$5: C28.1 C30.2 L2.2 U2.4(ANTN)
N$6: C30.1 L4.2
N$7: C31.1 L3.1 L6.2
N$8: C37.2 U2.28(CLK16P) X1.1(XI)
N$9: C33.1 C34.1 C36.2 L6.1 L7.2
N$11: C38.2 U2.27(CLK16N) X1.2(XO)
N$17: C42.1 R7.2 U1.1(B:VBAT)
VCC_3V3_IO: C1.1 C2.1 C3.1 C4.1 C5.1 C6.1 C7.1 C8.1 C9.1 C10.1 C11.1 C12.1 C13.1 C14.1 C15.1 C16.1 C17.1 C18.1 C19.1 C20.1 C21.1 C22.1 C23.1 C24.1 C25.1 C26.1 C39.1 JTAG1.1 R2.1 R4.1 R5.1 R6.1 R7.1 U1.13(B:VDDA/VREF+) U1.19(B:VDD_2) U1.32(B:VDD_3) U1.48(B:VDD_4) U1.64(B:VDD) U2.1(VDD_ANA) U2.7(VDD_ANA) U2.23(VDD_IO) U3.5(V+) ; also sheet 2,3,4,6
VSS: C1.2 C2.2 C3.2 C4.2 C5.2 C6.2 C7.2 C8.2 C9.2 C10.2 C11.2 C12.2 C13.2 C14.2 C15.2 C16.2 C17.2 C18.2 C19.2 C20.2 C21.2 C22.2 C23.2 C24.2 C25.2 C26.2 C27.2 C28.2 C31.2 C32.2 C34.2 C35.2 C37.1 C38.1 C39.2 C40.2 C41.2 C42.2 JTAG1.3 JTAG1.5 JTAG1.9 L1.1 L2.1 L5.1 R1.2 R3.2 U1.12(B:VSSA/VREF-) U1.18(B:VSS_2) U1.31(B:VSS_3) U1.47(B:VSS_4) U1.63(B:VSS) U2.2(GND) U2.6(GND) U2.25(GPADC1) U2.26(GPADC2) U2.29(GND) U3.3(V-) X4.2(VSS) ; also sheet 2,3,4,6
Unconnected: JTAG1.7 U1.2(A:PC13) U1.8(A:PC0) U1.9(A:PC1) U1.10(A:PC2) U1.11(A:PC3) U1.14(A:PA0) U1.15(A:PA1) U1.16(A:PA2) U1.17(A:PA3) U1.24(A:PC4) U1.25(A:PC5) U1.26(A:PB0) U1.27(A:PB1) U1.28(A:PB2) U1.29(A:PB10) U1.30(A:PB11) U1.33(A:PB12) U1.34(A:PB13) U1.35(A:PB14) U1.36(A:PB15) U1.37(A:PC6) U1.38(A:PC7) U1.39(A:PC8) U1.40(A:PC9) U1.41(A:PA8) U1.42(A:PA9) U1.43(A:PA10) U1.44(A:PA11) U1.45(A:PA12) U1.46(A:PA13) U1.49(A:PA14) U1.50(A:PA15) U1.51(A:PC10) U1.52(A:PC11) U1.53(A:PC12) U1.54(A:PD2) U1.55(A:PB3) U1.56(A:PB4) U1.57(A:PB5) U1.58(A:PB6) U1.59(A:PB7) U1.61(A:PB8) U1.62(A:PB9) U2.5(ANTP1) U2.8(FILT) U2.11(DATA) U2.12(DCLK) U2.13(SYSCLK) U2.18(NC) U2.20(PWRAMP) U2.21(ANTSEL) U2.22(NC) U2.24(NC)

### Notes on the sheet
- MCU Power Block
- Single-ended RF transceiver
- Note: 868/915 MHz operation
- Note: for DNI values, reference the AX5043 datasheet
- Note: 50 ohm impedance for all RF traces
- Note: 0R indicates placement of a 0 ohm
   bridge resistor in place of the inductor

## Sheet 6 of 6: RF Switch
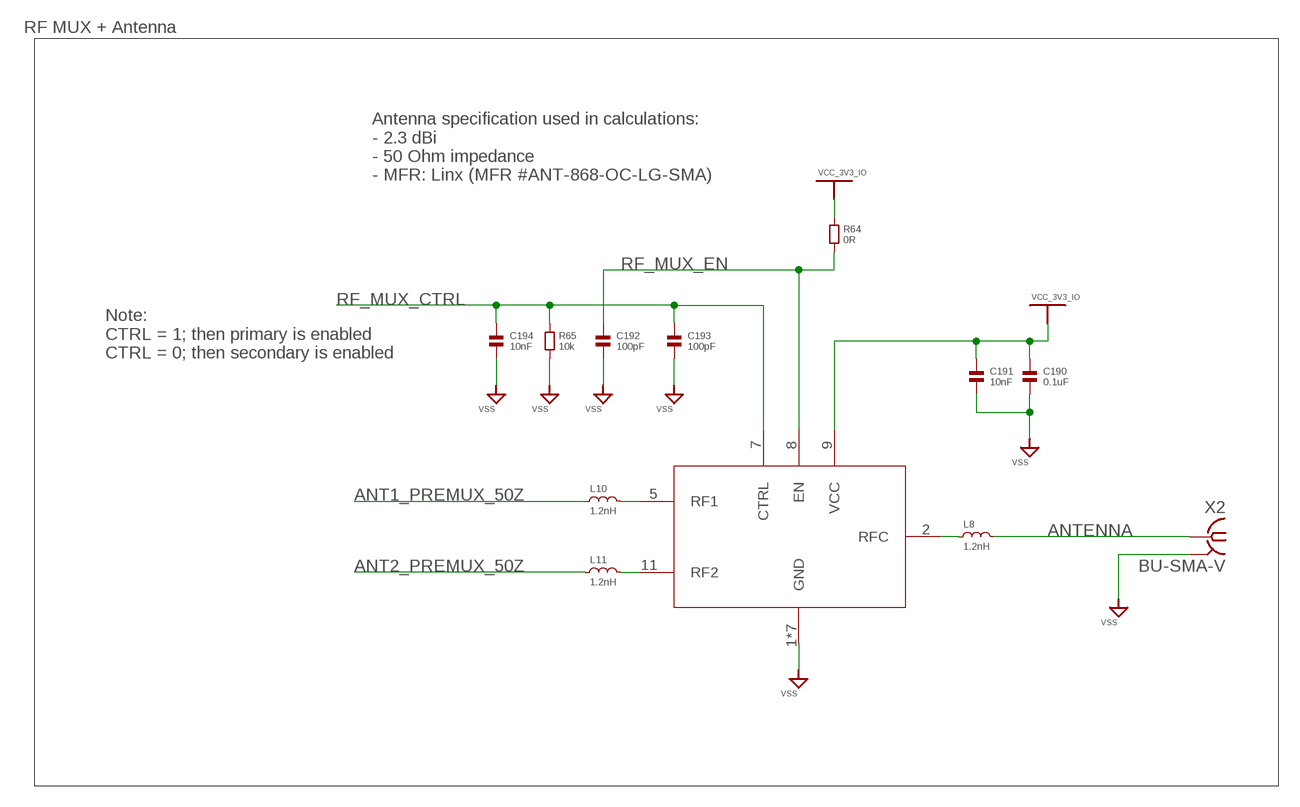
[diagram p6: schematic, sheet 6]

### Parts
C190  0.1uF  CAPACITOR.0603  [0603]
C191  10nF  CAPACITOR.0603  [0603]
C192  100pF  CAPACITOR.0603  [0603]
C193  100pF  CAPACITOR.0603  [0603]
C194  10nF  CAPACITOR.0603  [0603]
L8  1.2nH  RF-INDUCTOR.0402  [0402]
L10  1.2nH  RF-INDUCTOR.0402  [0402]
L11  1.2nH  RF-INDUCTOR.0402  [0402]
R64  0R  RESISTOR.0603  [0603]
R65  10k  RESISTOR.0603  [0603]
U17  QORVO-RF_SWITCH-QPC7512  [QORVO-RF_SWITCH-QPC7512]
X2  BU-SMA-V  [BU-SMA-V]

### Nets
ANT1_PREMUX_50Z: L10.1 ; also sheet 5
ANT2_PREMUX_50Z: L11.1
ANTENNA: L8.2 X2.1
N$40: L8.1 U17.2(RFC)
N$41: L11.2 U17.11(RF2)
N$42: L10.2 U17.5(RF1)
RF_MUX_CTRL: C193.1 C194.1 R65.1 U17.7(CTRL)
RF_MUX_EN: C192.1 R64.2 U17.8(EN)
VCC_3V3_IO: C190.1 C191.1 R64.1 U17.9(VCC) ; also sheet 2,3,4,5
VSS: C190.2 C191.2 C192.2 C193.2 C194.2 R65.2 U17.1(GND) U17.3(GND) U17.4(GND) U17.6(GND) U17.10(GND) U17.12(GND) U17.13(GND) X2.2 X2.3 X2.4 X2.5 ; also sheet 2,3,4,5

### Notes on the sheet
- RF MUX + Antenna
- Antenna specification used in calculations:
  - 2.3 dBi
  - 50 Ohm impedance
  - MFR: Linx (MFR #ANT-868-OC-LG-SMA)
- Note:
  CTRL = 1; then primary is enabled
  CTRL = 0; then secondary is enabled

## Power pins joined to a net without a drawn wire
VBAT: U4.6(C:VBAT)
VCAP_1: U4.71(C:VCAP_1)
VCAP_2: U4.106(C:VCAP_2)
VDD: U4.144(C:VDD)
VDD_2: U4.17(C:VDD_2)
VDD_3: U4.30(C:VDD_3)
VDD_4: U4.39(C:VDD_4)
VDD_5: U4.52(C:VDD_5)
VDD_6: U4.62(C:VDD_6)
VDD_7: U4.72(C:VDD_7)
VDD_8: U4.84(C:VDD_8)
VDD_9: U4.108(C:VDD_9)
VDD_10: U4.121(C:VDD_10)
VDD_11: U4.131(C:VDD_11)
VDDA: U4.33(C:VDDA)
VDDUSB: U4.95(C:VDDUSB)
VREF+: U4.32(C:VREF+)
VSS: U4.130(C:VSS)
VSS_2: U4.16(C:VSS_2)
VSS_3: U4.38(C:VSS_3)
VSS_4: U4.51(C:VSS_4)
VSS_5: U4.61(C:VSS_5)
VSS_6: U4.83(C:VSS_6)
VSS_7: U4.94(C:VSS_7)
VSS_8: U4.107(C:VSS_8)
VSS_9: U4.120(C:VSS_9)
VSSA/VREF: U4.31(C:VSSA/VREF)

## Library data of the parts
C1-C42 C137-C142 C157-C166 C190-C212 C267-C269 = standardparts:CAPACITOR
JP5-JP8 = pinhead:PINHD-1X2: PIN HEADER
JTAG1 = microbuilder:JTAG-CORTEXM3: Serial Wire (SW-DP) Connector This standard 0.05" 10-pin connector is for use with the Cortex M0/M3's native SWD (serial wire debugger) interface (SW-DP). Some boards support a 20-pin combined JTAG+SWD connector (SWJ-DP), such as the LPC1700 family, but many smaller devices only work with SWD which typically use the smaller 10-pin SW-DP connecter (the LPC1300 family, for example, only supports SWD). 2x05 1.27mm/0.05" Connector: This is the standard SMT connector defined by ARM for all Cortex devices, and should be used in most situations and for forward-compatibility since any new devices coming to market will likely use this connector. MOLEX 10 Pin 0.1" Connector: This 0.1" 10 pin connector has the same pin layout as the standard 0.05" connector, but is easier to work with if you are using standard jumper wires or custom cables to connect your SWD hardware. MOLEX 20 Pin 0.1" Connector: This 0.1" 20 pin connector is the same model used for ARM7/ARM9 JTAG debuggers, but is connected to match the pins on the Segger J-Link for ARM (which supports both JTAG and SWD debugging). See the following document from ARM for more information on Cortex M3 Debug Connectors: http://infocenter.arm.com/help/topic/com.arm.doc.faqs/attached/13634/cortex_debug_connectors.pdf And the following page for an overview with images of the different connector types: http://www.keil.com/peripherals/coresight/connectors.asp
L1-L8 L10 L11 = standardparts:RF-INDUCTOR
L12 = Module_Inductors:BOURNS-INDUCTOR-SRR1208-4R5ML
R1-R7 R13-R32 R53-R60 R64-R70 R73-R76 = standardparts:RESISTOR
U1 = Module_ICs:STMICROELECTRONICS-MICROCONTROLLER-STM32L431RCT6; BUILT_BY: EMA_UL_Team; COPYRIGHT: Copyright (C) 2018 Accelerated Designs. All rights reserved; MANUFACTURER_PART_NUMBER: STM32L431RCT6; SOURCELIBRARY: Updates_to_database_2020-10-19; VENDOR: STMicroelectronics
U2 = Module_ICs:ON_SEMICONDUCTOR-RF_TRANSCEIVER-AX5043
U3 = Module_Gates:TEXAS_INSTRUMENTS-AND_GATE-SN74LVC1G08DBVR; ALTERNATEPARTNUMBER: SN74LVC1G08DBVT; APPLICATION_BUILDNUMBER: *; COMPTYPE: IC; MANUFACTURER: Texas Instruments; MOUNTTYPE: SMT; PACKAGEREFERENCE: DBV0005A; PARTNUMBER: SN74LVC1G08DBVR; PIN_COUNT: 5; REFDES: RefDes; ROHS: Y; TYPE: TYPE
U4 = Module_ICs:STMICROELECTRONICS-MICROCONTROLLER-STM32F412ZGT6TR; BUILT_BY: EMA_UL_Team; COPYRIGHT: Copyright (C) 2018 Accelerated Designs. All rights reserved; MANUFACTURER_PART_NUMBER: STM32F412ZGT6TR; SOURCELIBRARY: STMicroelectronics_2020-10-07; VENDOR: STMicroelectronics
U7 U34 = tmp10x:TMP100: Digital Temperature sensor from Texas Instruments Digital output : I2C Resolution : 9 to 12bit Accuracy : 2'C from -25'C to 85'C ; 3'C from -55'C to 125'C Supply : 2,7 to 5,5V / 45uA (standby 0,1uA)
U8 U9 = BMX160:BMX160: IMU ACCEL/GYRO/MAG; AVAILABILITY: Unavailable; DESCRIPTION: IMU ACCEL/GYRO/MAG; MF: Bosch Sensortec; MP: BMX160; PACKAGE: VFLGA-14 Bosch Sensortec; PRICE: None
U10 U11 = Module_ICs:TEXAS_INSTRUMENTS-MOTOR_PWM_DRIVER-DRV8833CPWP; MANUFACTURER: Texas Instruments; PARTNUMBER: DRV8833CPWPR; REFDES: RefDes; TYPE: TYPE
U12 U13 U18 = Module_Regulators:TEXAS_INSTRUMENTS-CURRENT_MONITOR-INA226_DGS_10; DATASHEETURL: httpwww.ti.comlitgpnINA226; FAMILY_NAME: CURRENT SHUNT MONITOR; GENERIC_PART_NUMBER: INA226; INDUSTRY_STD_PKG_TYPE: MSOP; MANUFACTURER: Texas Instruments; MANUFACTURER_PART_NUMBER: ina226_dgs_10; PACKAGE_DESIGNATOR: DGS; PIN_COUNT: 10; VENDOR: Texas Instruments
U17 = Module_ICs:QORVO-RF_SWITCH-QPC7512
U19 = Module_Regulators:TEXAS_INSTRUMENTS-BUCK_CONVERTER-TPS53513RVER; BUILT_BY: EMA_Molly; COPYRIGHT: Copyright (C) 2018 Accelerated Designs. All rights reserved; MANUFACTURER_PART_NUMBER: TPS53513RVER; SOURCELIBRARY: TI_2019-05-24; VENDOR: Texas Instruments
X1 X3 = Module_ICs:ECS_INC-OSCILLATOR-ECS-160-20-23A-TR
X2 = con-coax:BU-SMA-V: FEMALE SMA CONNECTOR Radiall distributor RS 112-3794; OC_FARNELL: unknown; OC_NEWARK: unknown
X4 = Module_ICs:ECS_INC-OSCILLATOR-ECS-.327-12.5-1210B-N-TR
X6 = con-molex:5566-4: Mini FIT connector 4 pol Source: http://www.molex.com; MF: MOLEX; OC_FARNELL: unknown; OC_NEWARK: unknown